# Altium schematic sheet Server SoC I.schdoc
size 524 x 326 mm
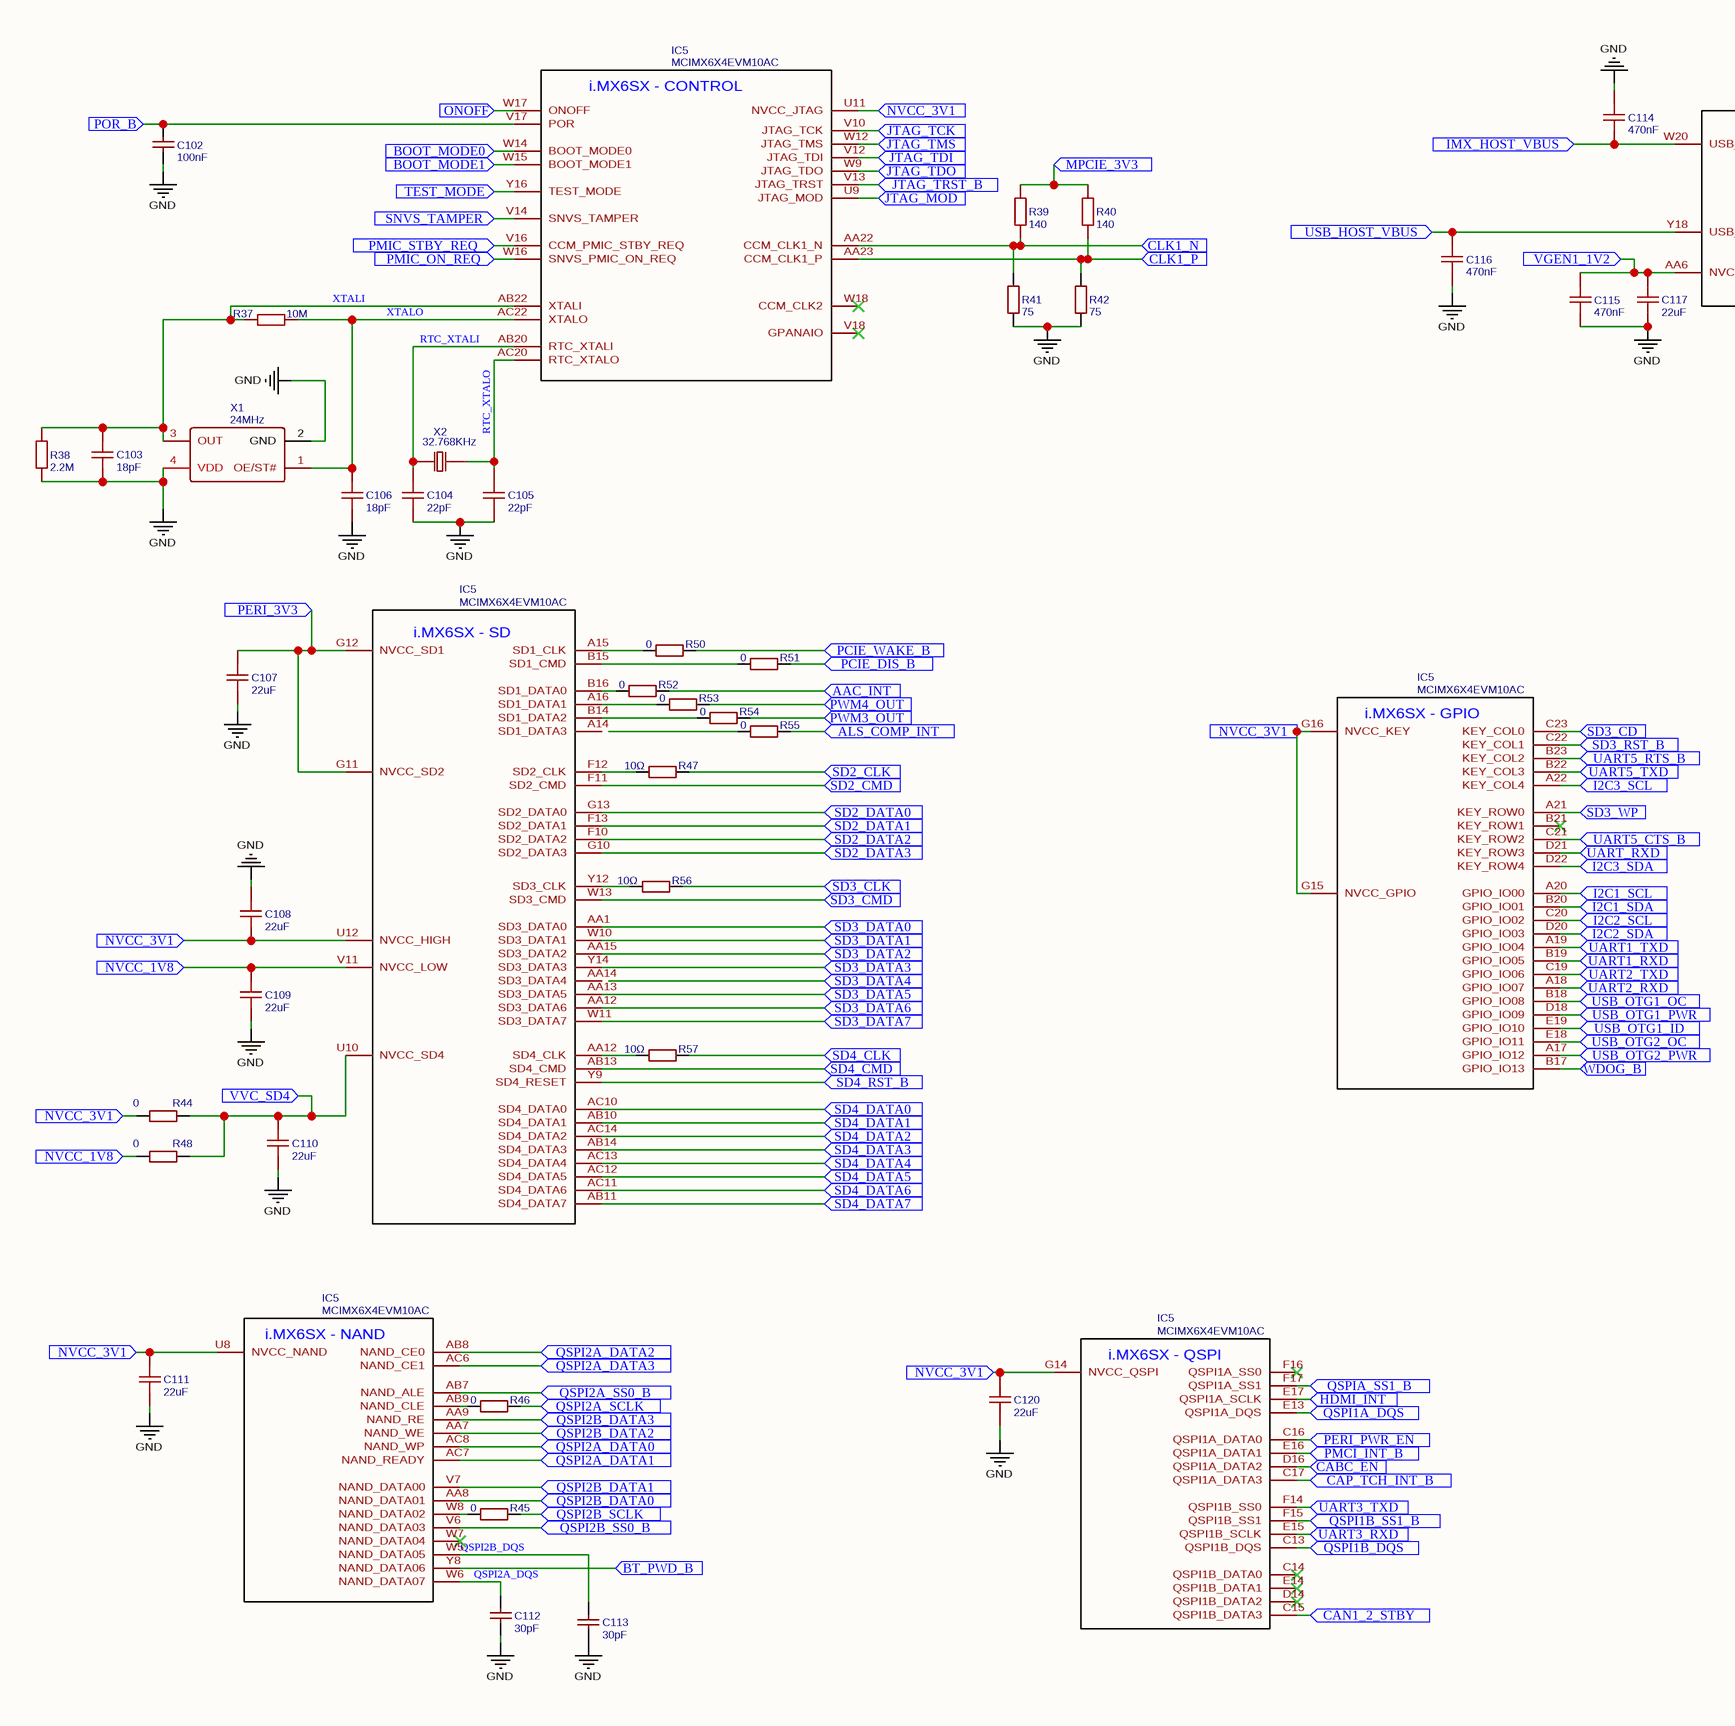
[diagram p0: Server SoC I.schdoc, left]
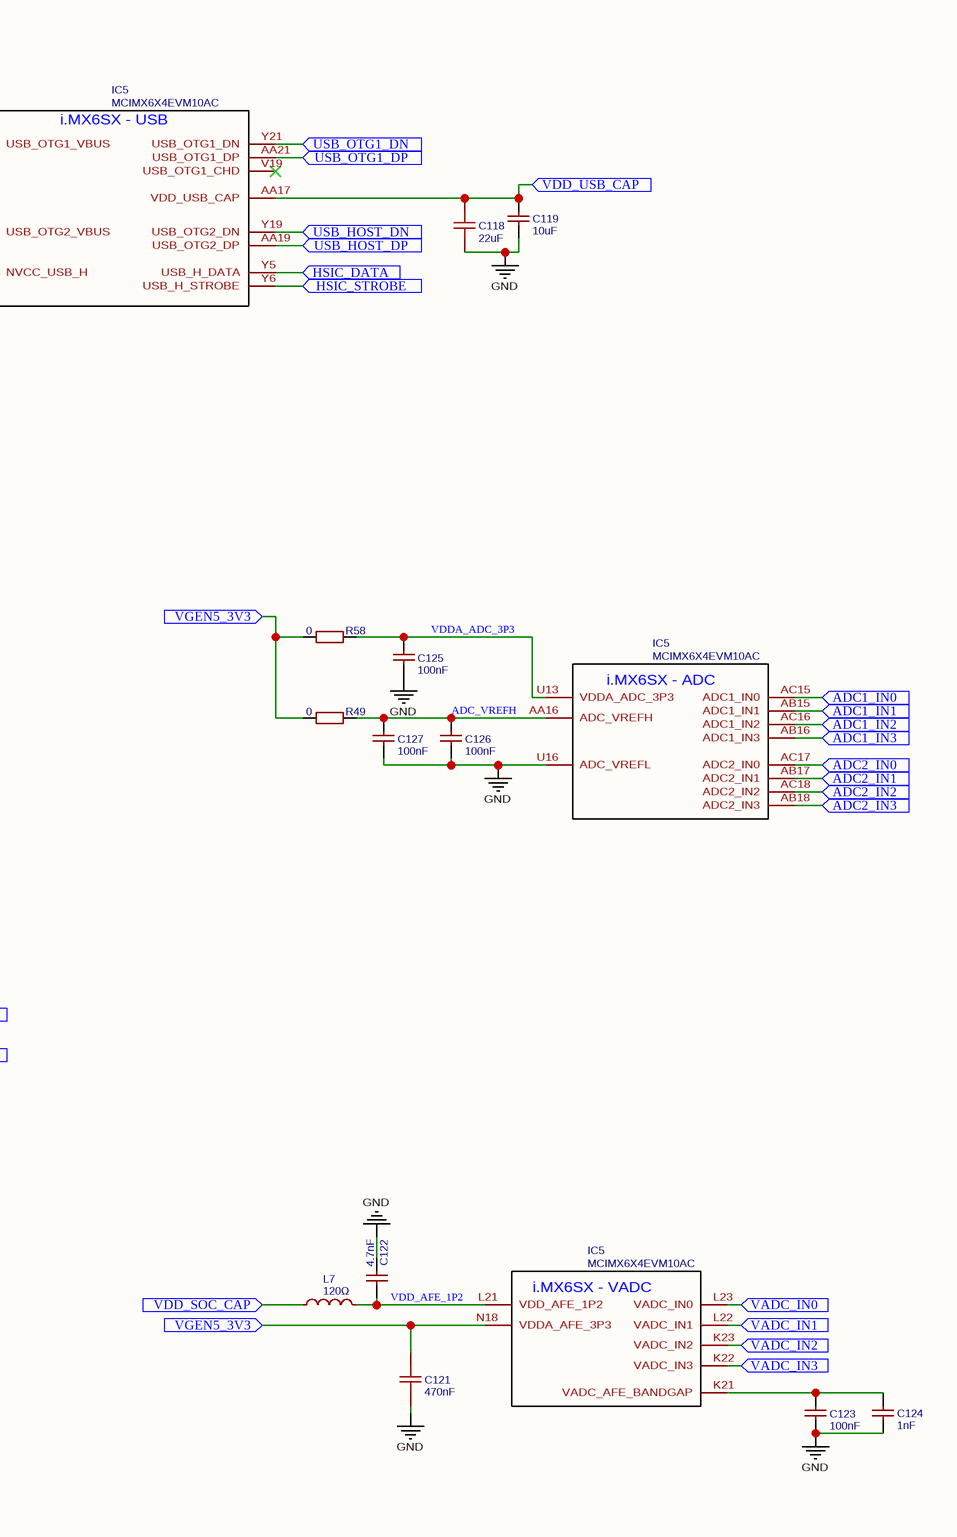
[diagram p1: Server SoC I.schdoc, right]

## Parts
(Parts that share a designator on the sheet are numbered #1, #2 ... from top to bottom, then left to right.)
C102  100nF  [C0805]
C103  18pF  [C0603]
C104  22pF  [C0603]
C105  22pF  [C0603]
C106  18pF  [C0603]
C107  22uF  [C0603]
C108  22uF  [C0603]
C109  22uF  [C0603]
C110  22uF  [C0603]
C111  22uF  [C0603]
C112  30pF  [C0402]
C113  30pF  [C0402]
C114  470nF  [C0402]
C115  470nF  [C0402]
C116  470nF  [C0402]
C117  22uF  [C0603]
C118  22uF  [C0603]
C119  10uF  [C0402]
C120  22uF  [C0603]
C121  470nF  [C0402]
C122  4.7nF  [C0805]
C123  100nF  [C0805]
C124  1nF  [C0402]
C125  100nF  [C0805]
C126  100nF  [C0805]
C127  100nF  [C0805]
IC5#1  MCIMX6X4EVM10AC  [BGA529C80P23X23_1900X1900X152]
IC5#2  MCIMX6X4EVM10AC  [BGA529C80P23X23_1900X1900X152]
IC5#3  MCIMX6X4EVM10AC  [BGA529C80P23X23_1900X1900X152]
IC5#4  MCIMX6X4EVM10AC  [BGA529C80P23X23_1900X1900X152]
IC5#5  MCIMX6X4EVM10AC  [BGA529C80P23X23_1900X1900X152]
IC5#6  MCIMX6X4EVM10AC  [BGA529C80P23X23_1900X1900X152]
IC5#7  MCIMX6X4EVM10AC  [BGA529C80P23X23_1900X1900X152]
IC5#8  MCIMX6X4EVM10AC  [BGA529C80P23X23_1900X1900X152]
L7  120Ω  [L0603]
R37  10M  [R0603]
R38  2.2M  [R0603]
R39  140  [R0402]
R40  140  [R0402]
R41  75  [R0603]
R42  75  [R0603]
R44  0  [R0402]
R45  0  [R0402]
R46  0  [R0402]
R47  10Ω  [R0603]
R48  0  [R0402]
R49  0  [R0402]
R50  0  [R0402]
R51  0  [R0402]
R52  0  [R0402]
R53  0  [R0402]
R54  0  [R0402]
R55  0  [R0402]
R56  10Ω  [R0603]
R57  10Ω  [R0603]
R58  0  [R0402]
X1  24MHz  [OSC-SMD_4P-L3.2-W2.5-BL_SIT1602AI]
X2  32.768KHz  [FC-135R_L3.2-W1.5]

## Ports
AAC_INT (in), ADC1_IN0 (in), ADC1_IN1 (in), ADC1_IN2 (in), ADC1_IN3 (in), ADC2_IN0 (in), ADC2_IN1 (in), ADC2_IN2 (in), ADC2_IN3 (in), ALS_COMP_INT (in), BOOT_MODE0 (in), BOOT_MODE1 (in), BT_PWD_B (in), CABC_EN (in), CAN1_2_STBY (in), CAP_TCH_INT_B (in), CLK1_N (in), CLK1_P (in), HDMI_INT (in), HSIC_DATA (in), HSIC_STROBE (in), I2C1_SCL (in), I2C1_SDA (in), I2C2_SCL (in), I2C2_SDA (in), I2C3_SCL (in), I2C3_SDA (in), IMX_HOST_VBUS (in), JTAG_MOD (in), JTAG_TCK (in), JTAG_TDI (in), JTAG_TDO (in), JTAG_TMS (in), JTAG_TRST_B (in), MPCIE_3V3 (in), NVCC_1V8 (in), NVCC_3V1 (in), ONOFF (in), PCIE_DIS_B (in), PCIE_WAKE_B (in), PERI_3V3 (in), PERI_PWR_EN (in), PMCI_INT_B (in), PMIC_ON_REQ (in), PMIC_STBY_REQ (in), POR_B (in), PWM3_OUT (in), PWM4_OUT (in), QSPI1A_DQS (in), QSPI1B_DQS (in), QSPI1B_SS1_B (in), QSPI2A_DATA0 (in), QSPI2A_DATA1 (in), QSPI2A_DATA2 (in), QSPI2A_DATA3 (in), QSPI2A_SCLK (in), QSPI2A_SS0_B (in), QSPI2B_DATA0 (in), QSPI2B_DATA1 (in), QSPI2B_DATA2 (in), QSPI2B_DATA3 (in), QSPI2B_SCLK (in), QSPI2B_SS0_B (in), QSPIA_SS1_B (in), SD2_CLK (in), SD2_CMD (in), SD2_DATA0 (in), SD2_DATA1 (in), SD2_DATA2 (in), SD2_DATA3 (in), SD3_CD (in), SD3_CLK (in), SD3_CMD (in), SD3_DATA0 (in), SD3_DATA1 (in), SD3_DATA2 (in), SD3_DATA3 (in), SD3_DATA4 (in), SD3_DATA5 (in), SD3_DATA6 (in), SD3_DATA7 (in), SD3_RST_B (in), SD3_WP (in), SD4_CLK (in), SD4_CMD (in), SD4_DATA0 (in), SD4_DATA1 (in), SD4_DATA2 (in), SD4_DATA3 (in), SD4_DATA4 (in), SD4_DATA5 (in), SD4_DATA6 (in), SD4_DATA7 (in), SD4_RST_B (in), SNVS_TAMPER (in), TEST_MODE (in), UART1_RXD (in), UART1_TXD (in), UART2_RXD (in), UART2_TXD (in), UART3_RXD (in), UART3_TXD (in), UART5_CTS_B (in), UART5_RTS_B (in), UART5_TXD (in), UART_RXD (in), USB_HOST_DN (in), USB_HOST_DP (in), USB_HOST_VBUS (in), USB_OTG1_DN (in), USB_OTG1_DP (in), USB_OTG1_ID (in), USB_OTG1_OC (in), USB_OTG1_PWR (in), USB_OTG2_OC (in), USB_OTG2_PWR (in), VADC_IN0 (in), VADC_IN1 (in), VADC_IN2 (in), VADC_IN3 (in), VDD_SOC_CAP (in), VDD_USB_CAP (in), VGEN1_1V2 (in), VGEN5_3V3 (in), VVC_SD4 (in), WDOG_B (in)

## Nets
GND: C102.1 C103.1 C104.1 C105.1 C106.1 C107.1 C108.2 C109.1 C110.1 C111.1 C112.1 C113.1 C114.2 C115.1 C116.1 C117.1 C118.1 C119.1 C120.1 C121.1 C122.2 C123.1 C124.1 C125.1 C126.1 C127.1 IC5#3.U16(ADC_VREFL) R38.1 R41.1 R42.1 X1.2(GND) X1.4(VDD)
AAC_INT: R52.2 ; port AAC_INT
ADC1_IN0: IC5#3.AC15(ADC1_IN0) ; port ADC1_IN0
ADC1_IN1: IC5#3.AB15(ADC1_IN1) ; port ADC1_IN1
ADC1_IN2: IC5#3.AC16(ADC1_IN2) ; port ADC1_IN2
ADC1_IN3: IC5#3.AB16(ADC1_IN3) ; port ADC1_IN3
ADC2_IN0: IC5#3.AC17(ADC2_IN0) ; port ADC2_IN0
ADC2_IN1: IC5#3.AB17(ADC2_IN1) ; port ADC2_IN1
ADC2_IN2: IC5#3.AC18(ADC2_IN2) ; port ADC2_IN2
ADC2_IN3: IC5#3.AB18(ADC2_IN3) ; port ADC2_IN3
ADC_VREFH: C126.2 C127.2 IC5#3.AA16(ADC_VREFH) R49.2
ALS_COMP_INT: R55.2 ; port ALS_COMP_INT
BOOT_MODE0: IC5#2.W14(BOOT_MODE0) ; port BOOT_MODE0
BOOT_MODE1: IC5#2.W15(BOOT_MODE1) ; port BOOT_MODE1
BT_PWD_B: IC5#7.Y8(NAND_DATA06) ; port BT_PWD_B
CABC_EN: IC5#8.D16(QSPI1A_DATA2) ; port CABC_EN
CAN1_2_STBY: IC5#8.C15(QSPI1B_DATA3) ; port CAN1_2_STBY
CAP_TCH_INT_B: IC5#8.C17(QSPI1A_DATA3) ; port CAP_TCH_INT_B
CLK1_N: IC5#2.AA22(CCM_CLK1_N) R39.1 R41.2 ; port CLK1_N
CLK1_P: IC5#2.AA23(CCM_CLK1_P) R40.1 R42.2 ; port CLK1_P
HDMI_INT: IC5#8.E17(QSPI1A_SCLK) ; port HDMI_INT
HSIC_DATA: IC5#1.Y5(USB_H_DATA) ; port HSIC_DATA
HSIC_STROBE: IC5#1.Y6(USB_H_STROBE) ; port HSIC_STROBE
I2C1_SCL: IC5#4.A20(GPIO_IO00) ; port I2C1_SCL
I2C1_SDA: IC5#4.B20(GPIO_IO01) ; port I2C1_SDA
I2C2_SCL: IC5#4.C20(GPIO_IO02) ; port I2C2_SCL
I2C2_SDA: IC5#4.D20(GPIO_IO03) ; port I2C2_SDA
I2C3_SCL: IC5#4.A22(KEY_COL4) ; port I2C3_SCL
I2C3_SDA: IC5#4.D22(KEY_ROW4) ; port I2C3_SDA
IMX_HOST_VBUS: C114.1 IC5#1.W20(USB_OTG1_VBUS) ; port IMX_HOST_VBUS
JTAG_MOD: IC5#2.U9(JTAG_MOD) ; port JTAG_MOD
JTAG_TCK: IC5#2.V10(JTAG_TCK) ; port JTAG_TCK
JTAG_TDI: IC5#2.V12(JTAG_TDI) ; port JTAG_TDI
JTAG_TDO: IC5#2.W9(JTAG_TDO) ; port JTAG_TDO
JTAG_TMS: IC5#2.W12(JTAG_TMS) ; port JTAG_TMS
JTAG_TRST_B: IC5#2.V13(JTAG_TRST) ; port JTAG_TRST_B
MPCIE_3V3: R39.2 R40.2 ; port MPCIE_3V3
NVCC_1V8: C109.2 IC5#5.V11(NVCC_LOW) R48.1 ; port NVCC_1V8
NVCC_3V1: C108.1 C111.2 C120.2 IC5#2.U11(NVCC_JTAG) IC5#4.G15(NVCC_GPIO) IC5#4.G16(NVCC_KEY) IC5#5.U12(NVCC_HIGH) IC5#7.U8(NVCC_NAND) IC5#8.G14(NVCC_QSPI) R44.1 ; port NVCC_3V1
ONOFF: IC5#2.W17(ONOFF) ; port ONOFF
PCIE_DIS_B: R51.2 ; port PCIE_DIS_B
PCIE_WAKE_B: R50.2 ; port PCIE_WAKE_B
PERI_3V3: C107.2 IC5#5.G11(NVCC_SD2) IC5#5.G12(NVCC_SD1) ; port PERI_3V3
PERI_PWR_EN: IC5#8.C16(QSPI1A_DATA0) ; port PERI_PWR_EN
PMCI_INT_B: IC5#8.E16(QSPI1A_DATA1) ; port PMCI_INT_B
PMIC_ON_REQ: IC5#2.W16(SNVS_PMIC_ON_REQ) ; port PMIC_ON_REQ
PMIC_STBY_REQ: IC5#2.V16(CCM_PMIC_STBY_REQ) ; port PMIC_STBY_REQ
POR_B: C102.2 IC5#2.V17(POR) ; port POR_B
PWM3_OUT: R54.2 ; port PWM3_OUT
PWM4_OUT: R53.2 ; port PWM4_OUT
QSPI1A_DQS: IC5#8.E13(QSPI1A_DQS) ; port QSPI1A_DQS
QSPI1B_DQS: IC5#8.C13(QSPI1B_DQS) ; port QSPI1B_DQS
QSPI1B_SS1_B: IC5#8.F15(QSPI1B_SS1) ; port QSPI1B_SS1_B
QSPI2A_DATA0: IC5#7.AC8(NAND_WP) ; port QSPI2A_DATA0
QSPI2A_DATA1: IC5#7.AC7(NAND_READY) ; port QSPI2A_DATA1
QSPI2A_DATA2: IC5#7.AB8(NAND_CE0) ; port QSPI2A_DATA2
QSPI2A_DATA3: IC5#7.AC6(NAND_CE1) ; port QSPI2A_DATA3
QSPI2A_DQS: C112.2 IC5#7.W6(NAND_DATA07)
QSPI2A_SCLK: R46.2 ; port QSPI2A_SCLK
QSPI2A_SS0_B: IC5#7.AB7(NAND_ALE) ; port QSPI2A_SS0_B
QSPI2B_DATA0: IC5#7.AA8(NAND_DATA01) ; port QSPI2B_DATA0
QSPI2B_DATA1: IC5#7.V7(NAND_DATA00) ; port QSPI2B_DATA1
QSPI2B_DATA2: IC5#7.AA7(NAND_WE) ; port QSPI2B_DATA2
QSPI2B_DATA3: IC5#7.AA9(NAND_RE) ; port QSPI2B_DATA3
QSPI2B_DQS: C113.2 IC5#7.W5(NAND_DATA05)
QSPI2B_SCLK: R45.2 ; port QSPI2B_SCLK
QSPI2B_SS0_B: IC5#7.V6(NAND_DATA03) ; port QSPI2B_SS0_B
QSPIA_SS1_B: IC5#8.F17(QSPI1A_SS1) ; port QSPIA_SS1_B
RTC_XTALI: C104.2 IC5#2.AB20(RTC_XTALI) X2.1
RTC_XTALO: C105.2 IC5#2.AC20(RTC_XTALO) X2.2
SD2_CLK: R47.2 ; port SD2_CLK
SD2_CMD: IC5#5.F11(SD2_CMD) ; port SD2_CMD
SD2_DATA0: IC5#5.G13(SD2_DATA0) ; port SD2_DATA0
SD2_DATA1: IC5#5.F13(SD2_DATA1) ; port SD2_DATA1
SD2_DATA2: IC5#5.F10(SD2_DATA2) ; port SD2_DATA2
SD2_DATA3: IC5#5.G10(SD2_DATA3) ; port SD2_DATA3
SD3_CD: IC5#4.C23(KEY_COL0) ; port SD3_CD
SD3_CLK: R56.2 ; port SD3_CLK
SD3_CMD: IC5#5.W13(SD3_CMD) ; port SD3_CMD
SD3_DATA0: IC5#5.AA1(SD3_DATA0) ; port SD3_DATA0
SD3_DATA1: IC5#5.W10(SD3_DATA1) ; port SD3_DATA1
SD3_DATA2: IC5#5.AA15(SD3_DATA2) ; port SD3_DATA2
SD3_DATA3: IC5#5.Y14(SD3_DATA3) ; port SD3_DATA3
SD3_DATA5: IC5#5.AA13(SD3_DATA5) ; port SD3_DATA5
SD3_DATA6: IC5#5.AA12(SD3_DATA6) ; port SD3_DATA6
SD3_DATA7: IC5#5.W11(SD3_DATA7) ; port SD3_DATA7
SD3_RST_B: IC5#4.C22(KEY_COL1) ; port SD3_RST_B
SD3_WP: IC5#4.A21(KEY_ROW0) ; port SD3_WP
SD4_CLK: R57.2 ; port SD4_CLK
SD4_CMD: IC5#5.AB13(SD4_CMD) ; port SD4_CMD
SD4_DATA0: IC5#5.AC10(SD4_DATA0) ; port SD4_DATA0
SD4_DATA1: IC5#5.AB10(SD4_DATA1) ; port SD4_DATA1
SD4_DATA2: IC5#5.AC14(SD4_DATA2) ; port SD4_DATA2
SD4_DATA3: IC5#5.AB14(SD4_DATA3) ; port SD4_DATA3
SD4_DATA4: IC5#5.AC13(SD4_DATA4) ; port SD4_DATA4
SD4_DATA5: IC5#5.AC12(SD4_DATA5) ; port SD4_DATA5
SD4_DATA6: IC5#5.AC11(SD4_DATA6) ; port SD4_DATA6
SD4_DATA7: IC5#5.AB11(SD4_DATA7) ; port SD4_DATA7
SD4_RST_B: IC5#5.Y9(SD4_RESET) ; port SD4_RST_B
SNVS_TAMPER: IC5#2.V14(SNVS_TAMPER) ; port SNVS_TAMPER
TEST_MODE: IC5#2.Y16(TEST_MODE) ; port TEST_MODE
UART1_RXD: IC5#4.B19(GPIO_IO05) ; port UART1_RXD
UART1_TXD: IC5#4.A19(GPIO_IO04) ; port UART1_TXD
UART2_RXD: IC5#4.A18(GPIO_IO07) ; port UART2_RXD
UART2_TXD: IC5#4.C19(GPIO_IO06) ; port UART2_TXD
UART3_RXD: IC5#8.E15(QSPI1B_SCLK) ; port UART3_RXD
UART3_TXD: IC5#8.F14(QSPI1B_SS0) ; port UART3_TXD
UART5_CTS_B: IC5#4.C21(KEY_ROW2) ; port UART5_CTS_B
UART5_RTS_B: IC5#4.B23(KEY_COL2) ; port UART5_RTS_B
UART5_TXD: IC5#4.B22(KEY_COL3) ; port UART5_TXD
UART_RXD: IC5#4.D21(KEY_ROW3) ; port UART_RXD
USB_HOST_DN: IC5#1.Y19(USB_OTG2_DN) ; port USB_HOST_DN
USB_HOST_DP: IC5#1.AA19(USB_OTG2_DP) ; port USB_HOST_DP
USB_HOST_VBUS: C116.2 IC5#1.Y18(USB_OTG2_VBUS) ; port USB_HOST_VBUS
USB_OTG1_DN: IC5#1.Y21(USB_OTG1_DN) ; port USB_OTG1_DN
USB_OTG1_DP: IC5#1.AA21(USB_OTG1_DP) ; port USB_OTG1_DP
USB_OTG1_ID: IC5#4.E19(GPIO_IO10) ; port USB_OTG1_ID
USB_OTG1_OC: IC5#4.B18(GPIO_IO08) ; port USB_OTG1_OC
USB_OTG1_PWR: IC5#4.D18(GPIO_IO09) ; port USB_OTG1_PWR
USB_OTG2_OC: IC5#4.E18(GPIO_IO11) ; port USB_OTG2_OC
USB_OTG2_PWR: IC5#4.A17(GPIO_IO12) ; port USB_OTG2_PWR
VADC_IN0: IC5#6.L23(VADC_IN0) ; port VADC_IN0
VADC_IN1: IC5#6.L22(VADC_IN1) ; port VADC_IN1
VADC_IN2: IC5#6.K23(VADC_IN2) ; port VADC_IN2
VADC_IN3: IC5#6.K22(VADC_IN3) ; port VADC_IN3
VDD_AFE_1P2: C122.1 IC5#6.L21(VDD_AFE_1P2) L7.2
VDD_SOC_CAP: L7.1 ; port VDD_SOC_CAP
VDD_USB_CAP: C118.2 C119.2 IC5#1.AA17(VDD_USB_CAP) ; port VDD_USB_CAP
VDDA_ADC_3P3: C125.2 IC5#3.U13(VDDA_ADC_3P3) R58.2
VGEN1_1V2: C115.2 C117.2 IC5#1.AA6(NVCC_USB_H) ; port VGEN1_1V2
VGEN5_3V3: C121.2 IC5#6.N18(VDDA_AFE_3P3) R49.1 R58.1 ; port VGEN5_3V3
VVC_SD4: C110.2 IC5#5.U10(NVCC_SD4) R44.2 R48.2 ; port VVC_SD4
WDOG_B: IC5#4.B17(GPIO_IO13) ; port WDOG_B
XTALI: C103.2 IC5#2.AB22(XTALI) R37.1 R38.2 X1.3(OUT)
XTALO: C106.2 IC5#2.AC22(XTALO) R37.2 X1.1(OE/ST#)
NetC123_2: C123.2 C124.2 IC5#6.K21(VADC_AFE_BANDGAP)
NetIC5#5_A15: IC5#5.A15(SD1_CLK) R50.1
NetIC5#5_A16: IC5#5.A16(SD1_DATA1) R53.1
NetIC5#5_AA12: IC5#5.AA12(SD4_CLK) R57.1
NetIC5#5_B14: IC5#5.B14(SD1_DATA2) R54.1
NetIC5#5_B15: IC5#5.B15(SD1_CMD) R51.1
NetIC5#5_B16: IC5#5.B16(SD1_DATA0) R52.1
NetIC5#5_F12: IC5#5.F12(SD2_CLK) R47.1
NetIC5#5_Y12: IC5#5.Y12(SD3_CLK) R56.1
NetIC5#7_AB9: IC5#7.AB9(NAND_CLE) R46.1
NetIC5#7_W8: IC5#7.W8(NAND_DATA02) R45.1

Not connected (* = marked no-connect by the designer): IC5#1 V19(USB_OTG1_CHD)*; IC5#2 V18(GPANAIO)* W18(CCM_CLK2)*; IC5#4 B21(KEY_ROW1)*; IC5#5 A14(SD1_DATA3) AA14(SD3_DATA4); IC5#7 W7(NAND_DATA04)*; IC5#8 C14(QSPI1B_DATA0)* D14(QSPI1B_DATA2)* E14(QSPI1B_DATA1)* F16(QSPI1A_SS0)*; R55 1

## Notes on the sheet
- (in symbol MCIMX6X4EVM10AC) i.MX6SX - CONTROL; i.MX6SX - SD; i.MX6SX - NAND; i.MX6SX - GPIO; i.MX6SX - QSPI; i.MX6SX - USB; i.MX6SX - ADC; i.MX6SX - VADC

## Library data of the parts
C102 C123 C125-C127 = 100nF: BOM_Manufacturer Part: CC0805KRX7R9BB104; BOM_Manufacturer: YAGEO; nameAlias: Capacitance; SMT Type: Basic; BOM_Supplier: LCSC; BOM_LCSC Assembly: Yes; BOM_Supplier Part: C49678; spicePre: C; spiceSymbolName: CC0805KRX7R9BB104
C103 C106 = 18pF: BOM_Manufacturer: Murata Electronics; BOM_Manufacturer Part: GCM1885C1H180FA16D; nameAlias: Capacitance; Contributor: LCSC; SMT Type: Extend; BOM_Supplier: LCSC; BOM_Supplier Part: C126551; BOM_LCSC Assembly: Yes; spicePre: C; spiceSymbolName: GCM1885C1H180FA16D
C104 C105 = 22pF: BOM_Manufacturer: Walsin Tech Corp; BOM_Manufacturer Part: 0603N220G500CT; nameAlias: Capacitance; Contributor: LCSC; SMT Type: Extend; BOM_Supplier: LCSC; BOM_Supplier Part: C388039; BOM_LCSC Assembly: Yes; spicePre: C; spiceSymbolName: 0603N220G500CT
C107-C111 C117 C118 C120 = 22uF: BOM_Manufacturer: SAMSUNG; BOM_Manufacturer Part: CL10A226MP8NUNE; nameAlias: Capacitance; SMT Type: Extend; BOM_Supplier: LCSC; BOM_Supplier Part: C86295; BOM_LCSC Assembly: Yes; spicePre: C; spiceSymbolName: CL10A226MP8NUNE
C112 C113 = 30pF: BOM_Manufacturer: FH; BOM_Manufacturer Part: 0402CG300J500NT; nameAlias: Capacitance; SMT Type: Basic; BOM_Supplier: LCSC; BOM_LCSC Assembly: Yes; BOM_Supplier Part: C1570; spicePre: C; spiceSymbolName: 0402CG300J500NT
C114-C116 C121 = 470nF: BOM_Manufacturer: Samsung Electro-Mechanics; BOM_Manufacturer Part: CL05A474KA5NNNC; nameAlias: Capacitance; Contributor: LCSC; SMT Type: Extend; BOM_Supplier: LCSC; BOM_Supplier Part: C92361; BOM_LCSC Assembly: Yes; spicePre: C; spiceSymbolName: CL05A474KA5NNNC
C119 = 10uF: BOM_Manufacturer Part: CL05A106MQ5NUNC; BOM_Manufacturer: SAMSUNG; nameAlias: Capacitance; SMT Type: Basic; BOM_Supplier: LCSC; BOM_LCSC Assembly: Yes; BOM_Supplier Part: C15525; spicePre: C; spiceSymbolName: CL05A106MQ5NUNC
C122 = 4.7nF: BOM_Manufacturer: FH; BOM_Manufacturer Part: 0805B472K500NT; nameAlias: Capacitance; SMT Type: Basic; BOM_Supplier: LCSC; BOM_LCSC Assembly: Yes; BOM_Supplier Part: C1744; spicePre: C; spiceSymbolName: 0805B472K500NT
C124 = 1nF: BOM_Manufacturer: FH; BOM_Manufacturer Part: 0402B102K500NT; nameAlias: Capacitance; SMT Type: Basic; BOM_Supplier: LCSC; BOM_LCSC Assembly: Yes; BOM_Supplier Part: C1523; spicePre: C; spiceSymbolName: 0402B102K500NT
IC5#1-IC5#8 = MCIMX6X4EVM10AC: subpart_no: 1; Contributor: Ke'Ondrae_Mell; spicePre: I; spiceSymbolName: MCIMX6X4EVM10AC
L7 = 120Ω: BOM_Manufacturer: Sunlord; BOM_Manufacturer Part: GZ1608D121TF; nameAlias: Value; SMT Type: Extend; BOM_Supplier: LCSC; BOM_Supplier Part: C18527; BOM_LCSC Assembly: Yes; spicePre: L; spiceSymbolName: GZ1608D121TF
R37 = 10M: BOM_Manufacturer: Tyohm; BOM_Manufacturer Part: RMC060310M5%N; nameAlias: Resistance (Ohms); Contributor: LCSC; BOM_Supplier: LCSC; BOM_Supplier Part: C325644; spicePre: R; spiceSymbolName: RMC060310M5%N
R38 = 2.2M: BOM_Manufacturer: Tyohm; BOM_Manufacturer Part: RMC06032.2M1%N; nameAlias: Resistance (Ohms); Contributor: LCSC; BOM_Supplier: LCSC; BOM_Supplier Part: C325674; spicePre: R; spiceSymbolName: RMC06032.2M1%N
R39 R40 = 140: BOM_Manufacturer: Guangdong Fenghua Advanced Tech; BOM_Manufacturer Part: RC-02W1400FT; nameAlias: Resistance (Ohms); Contributor: LCSC; BOM_Supplier: LCSC; BOM_Supplier Part: C321301; spicePre: R; spiceSymbolName: RC-02W1400FT
R41 R42 = 75: BOM_Manufacturer: YAGEO; BOM_Manufacturer Part: RC0603JR-0775RL; nameAlias: Resistance (Ohms); BOM_Supplier: LCSC; BOM_Supplier Part: C127449; spicePre: R; spiceSymbolName: RC0603JR-0775RL
R44-R46 R48-R55 R58 = 0: BOM_Manufacturer: KOA; BOM_Manufacturer Part: RK73Z1ETTP; nameAlias: Resistance (Ohms); BOM_Supplier: LCSC; BOM_Supplier Part: C131359; spicePre: R; spiceSymbolName: RK73Z1ETTP
R47 R56 R57 = 10Ω: BOM_Manufacturer: UniOhm; BOM_Manufacturer Part: 0603WAF100JT5E; nameAlias: Resistance (Ohms); SMT Type: Basic; BOM_Supplier: LCSC; BOM_LCSC Assembly: Yes; BOM_Supplier Part: C22859; spicePre: R; spiceSymbolName: 0603WAF100JT5E
X1 = 24MHz: BOM_Manufacturer: SITIME; BOM_Manufacturer Part: SIT1602AI-22-33E-24.000000D; nameAlias: Frequency; SMT Type: Extend; BOM_Supplier: LCSC; BOM_Supplier Part: C70741; BOM_LCSC Assembly: Yes; spicePre: X; spiceSymbolName: SIT1602AI-22-33E-24.000000D
X2 = 32.768KHz: BOM_Manufacturer Part: Q13FC1350000200; BOM_Manufacturer: EPSON; nameAlias: Frequency; SMT Type: Extend; BOM_Supplier: LCSC; BOM_Supplier Part: C48615; BOM_LCSC Assembly: Yes; spicePre: X; spiceSymbolName: Q13FC1350000200